# EAGLE design Qwiic_RFID_Tag (EAGLE 9.6.2)
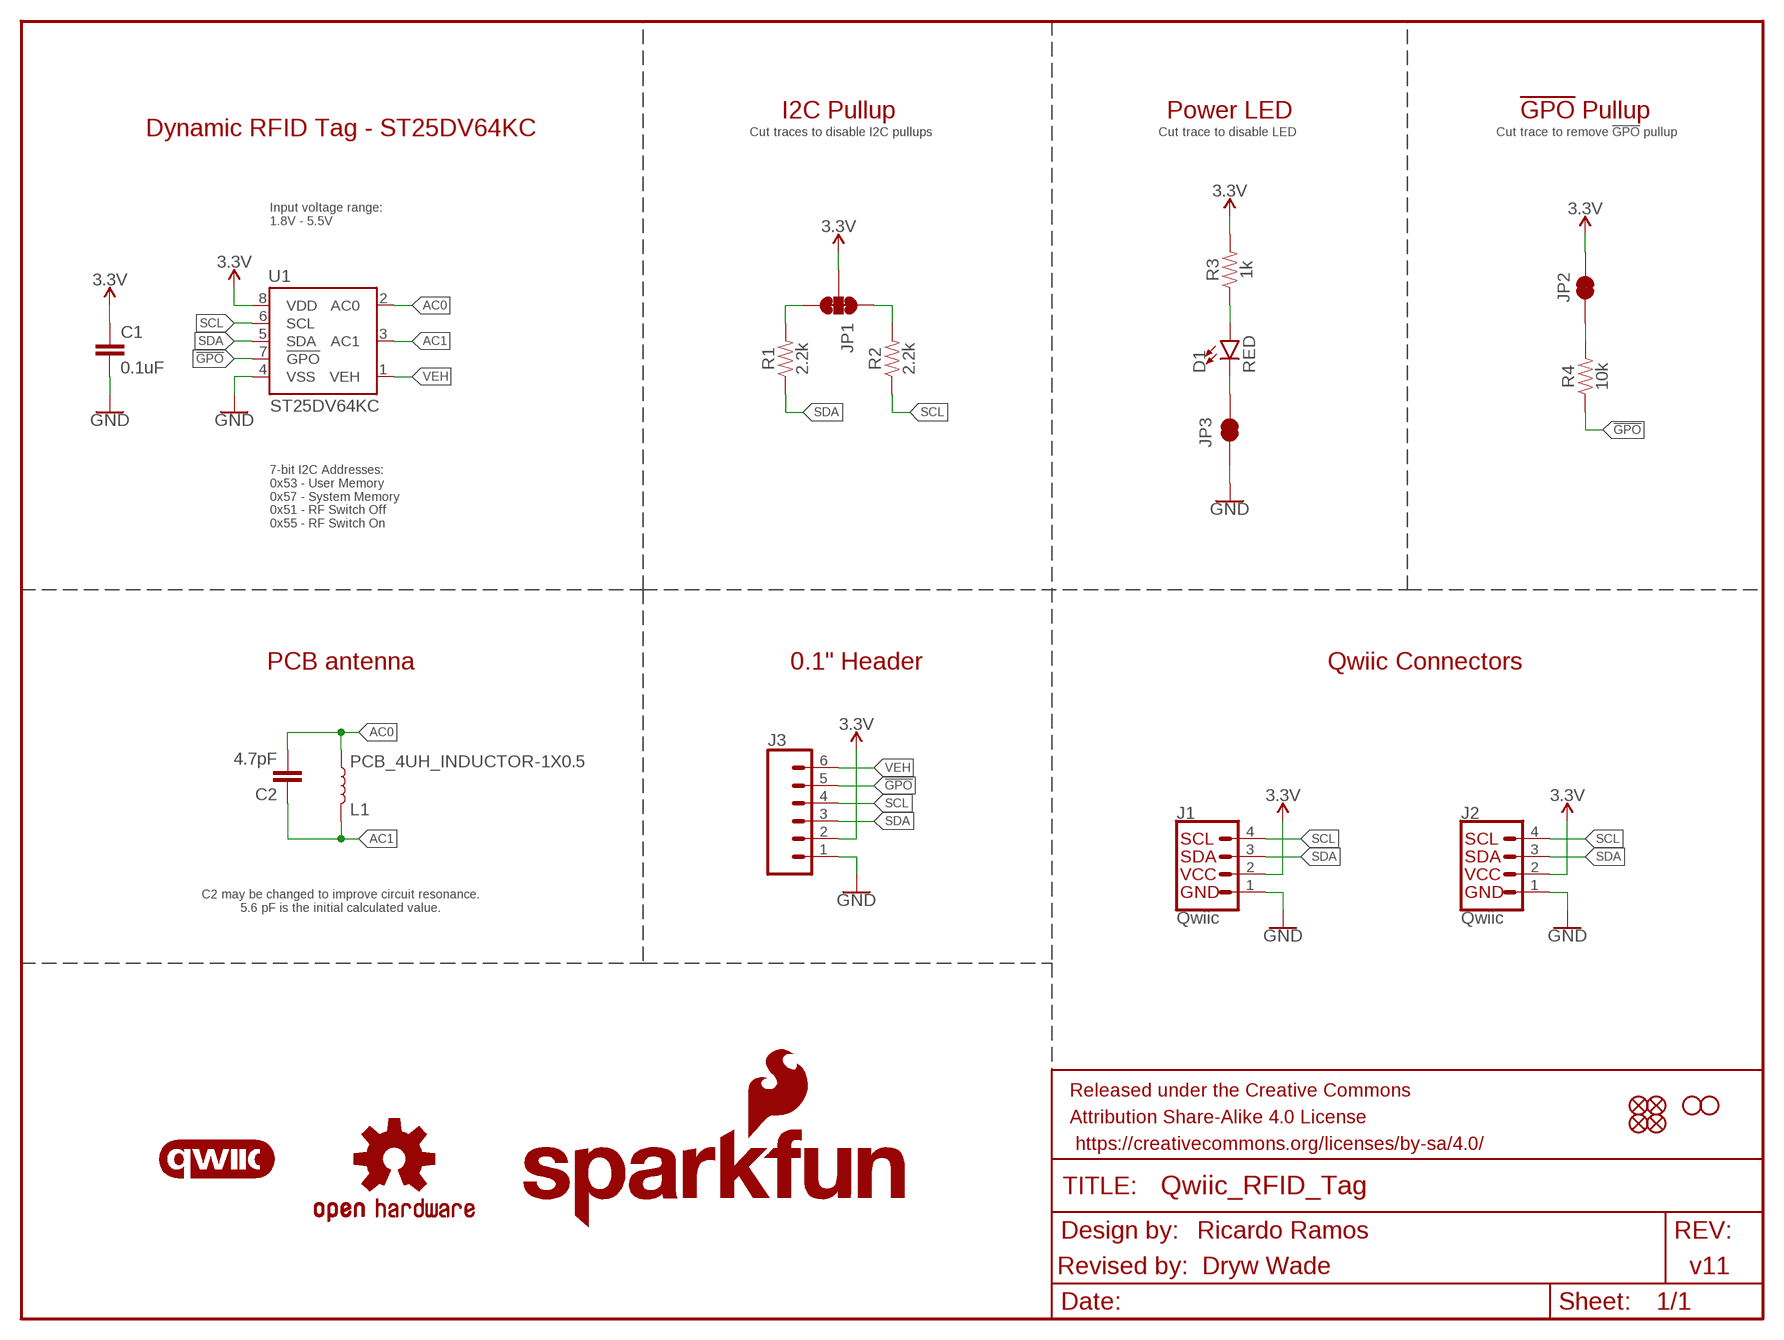
[diagram p0: schematic, sheet 1]

## Parts
C1  0.1uF  0.1UF-0603-25V-(+80/-20%)  [0603]
C2  4.7pF  4.7PF-0603-50V-5%  [0603]
D1  RED  LED-RED0603  [LED-0603]
FD1  FIDUCIAL1X2  [FIDUCIAL-1X2]
FD2  FIDUCIAL1X2  [FIDUCIAL-1X2]
FD3  FIDUCIAL1X2  [FIDUCIAL-1X2]
FD4  FIDUCIAL1X2  [FIDUCIAL-1X2]
FRAME2  FRAME-LETTER  [CREATIVE_COMMONS]
H3  STAND-OFF  [STAND-OFF]
H4  STAND-OFF  [STAND-OFF]
J1  Qwiic  QWIIC_CONNECTORJS-1MM  [JST04_1MM_RA]
J2  Qwiic  QWIIC_CONNECTORJS-1MM  [JST04_1MM_RA]
J3  CONN_06NO_SILK_FEMALE_PTH  [1X06_NO_SILK]
JP1  JUMPER-SMT_3_2-NC_TRACE_SILK  [SMT-JUMPER_3_2-NC_TRACE_SILK]
JP2  JUMPER-SMT_2_NC_TRACE_SILK  [SMT-JUMPER_2_NC_TRACE_SILK]
JP3  JUMPER-SMT_2_NC_TRACE_SILK  [SMT-JUMPER_2_NC_TRACE_SILK]
L1  PCB_4UH_INDUCTOR-1X0.5  [PCB_4UH_INDUCTOR_1X0.5]
LOGO1  OSHW-LOGOS  [OSHW-LOGO-S]
LOGO2  SFE_LOGO_NAME_FLAME.1_INCH  [SFE_LOGO_NAME_FLAME_.1]
LOGO3  QWIIC_LOGO_7MM  [QWIIC_7MM]
R1  2.2k  2.2KOHM-0603-1/10W-1%  [0603]
R2  2.2k  2.2KOHM-0603-1/10W-1%  [0603]
R3  1k  1KOHM-0603-1/10W-1%  [0603]
R4  10k  10KOHM-0603-1/10W-1%  [0603]
U1  ST25DV64KC  [SO08]

## Nets
3.3V: C1.1 J1.2 J2.2 J3.2 JP1.2 JP2.2 R3.2 U1.8(VDD)
!GPO!: J3.5 R4.1 U1.7(!GPO!)
AC0: C2.2 L1.IN2 U1.2(AC0)
AC1: C2.1 L1.IN1 U1.3(AC1)
GND: C1.2 J1.1 J2.1 J3.1 JP3.1 U1.4(VSS)
N$1: D1.C JP3.2
N$2: JP1.3 R1.2
N$3: JP1.1 R2.2
N$4: D1.A R3.1
N$5: JP2.1 R4.2
SCL: J1.4 J2.4 J3.4 R2.1 U1.6(SCL)
SDA: J1.3 J2.3 J3.3 R1.1 U1.5(SDA)
VEH: J3.6 U1.1(VEH)

## Notes on the sheet
- I2C Pullup | Power LED | !GPO! Pullup
- Dynamic RFID Tag - ST25DV64KC
- Cut traces to disable I2C pullups | Cut trace to disable LED | Cut trace to remove !GPO! pullup
- Input voltage range:
  1.8V - 5.5V
- 7-bit I2C Addresses:
  0x53 - User Memory
  0x57 - System Memory
  0x51 - RF Switch Off
  0x55 - RF Switch On
- PCB antenna | 0.1" Header | Qwiic Connectors
- C2 may be changed to improve circuit resonance.
  5.6 pF is the initial calculated value.
- Ricardo Ramos
- Revised by:  Dryw Wade | v11

## Library data of the parts
C1 = SparkFun-Capacitors:0.1UF: 0.1µF ceramic capacitors A capacitor is a passive two-terminal electrical component used to store electrical energy temporarily in an electric field.; PROD_ID: CAP-00810
C2 = SparkFun-Capacitors:4.7PF: 4.7pF ceramic capacitors A capacitor is a passive two-terminal electrical component used to store electrical energy temporarily in an electric field.; PROD_ID: CAP-07880
D1 = SparkFun-LED:LED-RED: Red SMD LED Used in manufacturing of most products at SparkFun Packages: 0603 - SMD 0603 package [Product Link] <http://docs.avagotech.com/docs/AV02-0551EN> 0603 SMART - SMD 0603 SMART package ( more efficient and expensive)[Product Link] <http://www.osram-os.com/Graphics/XPic2/00077099_0.pdf> 1206 - SMD1206 package [Product Link] <https://www.sparkfun.com/datasheets/DevTools/LilyPad/Q150OVS4.pdff> SparkFun Products: Pro Mini 328 -5V <https://www.sparkfun.com/products/821> RedBoard <https://www.sparkfun.com/products/12757> IOIO-OTG <https://www.sparkfun.com/products/13613>; PROD_ID: DIO-00819
FD1-FD4 = SparkFun-Aesthetics:FIDUCIAL: Fiducial Alignment Points Point-of-reference for pick-and-place machines and other optical instruments.
FRAME2 = SparkFun-Aesthetics:FRAME-LETTER: Schematic Frame - Letter Standard 8.5x11 US Letter frame
H3 H4 = SparkFun-Hardware:STAND-OFF: Stand Off Drill holes for mechanically mounting via screws, standoffs, etc. Note: Use the keepout ring to avoid running the screw head into surrounding components. Variant Overviews STAND-OFF - Mechanical footprint for a #4 phillips button head screw. STAND-OFF-TIGHT - Mechanical footprint for a #4 phillips button head screw, Example SparkFun Products Screw - Phillips Head (1/4", 4-40, 10 pack) <https://www.sparkfun.com/products/10453> (PRT-10453) Screw - Phillips Head (1/2", 4-40, 10 pack) <https://www.sparkfun.com/products/10452> (PRT-10452) Screw - Phillips Head (3/4", 4-40, 10 pack) <https://www.sparkfun.com/products/10451> (PRT-10451) Screw - Phillips Head (1", 4-40, 10 pack) <https://www.sparkfun.com/products/10450> (PRT-10450)
J1 J2 = SparkFun-Connectors:QWIIC_CONNECTOR: SparkFun I2C Standard Qwiic Connector An SMD 1mm pitch JST connector makes it easy and quick (get it? Qwiic?) to connect I2C devices to each other. The Qwiic system <http://www.sparkfun.com/qwiic> enables fast and solderless connection between popular platforms and various sensors and actuators. We carry 200mm <https://www.sparkfun.com/products/14204>, 100mm <https://www.sparkfun.com/products/14205>, 50mm <https://www.sparkfun.com/products/14206>, and breadboard friendly <https://www.sparkfun.com/products/14207> Qwiic cables. We also offer 10 pcs strips <https://www.sparkfun.com/products/14323> the SMD connectors.; PROD_ID: CONN-13694; VALUE: QWIIC_RIGHT_ANGLE
J3 = SparkFun-Connectors:CONN_06: Multi connection point. Often used as Generic Header-pin footprint for 0.1 inch spaced/style header connections On any of the 0.1 inch spaced packages, you can populate with these: Break Away Headers - Straight <https://www.sparkfun.com/products/116> (PRT-00116) Break Away Male Headers - Right Angle <https://www.sparkfun.com/products/553> (PRT-00553) Female Headers <https://www.sparkfun.com/products/115> (PRT-00115) Break Away Headers - Machine Pin <https://www.sparkfun.com/products/117> (PRT-00117) Break Away Female Headers - Swiss Machine Pin <https://www.sparkfun.com/products/743> (PRT-00743) Arduino Stackable Header - 6 Pin <https://www.sparkfun.com/products/9280> (PRT-09280) Screw Terminals 2.54mm Pitch (6-Pin) <https://www.sparkfun.com/products/16499> (PRT-16499) For SCREWTERMINALS and SPRING TERMINALS visit here: Screw Terimnals on SparkFun.com <https://www.sparkfun.com/search/results?term=Screw+Terminals> (5mm/3.5mm/2.54mm spacing) This device is also useful as a general connection point to wire up your design to another part of your project. Our various solder wires solder well into these plated through hole pads. Hook-Up Wire - Assortment (Stranded, 22 AWG) <https://www.sparkfun.com/products/11375> (PRT-11375) Hook-Up Wire - Assortment (Solid Core, 22 AWG) <https://www.sparkfun.com/products/11367> (PRT-11367) View the entire wire category on our website here <https://www.sparkfun.com/categories/141>; PROD_ID: CONN-08437
JP1 = SparkFun-Jumpers:JUMPER-SMT_3_2-NC_TRACE: Normally closed trace jumper (2 of 2 connections) This jumper has a trace between all three pads so they are normally closed (NC). Use a razor knife to open the connection(s). For best results follow the IPC guidelines for cutting traces: Cutout at least 0.063 mm (0.005 in). Remove all loose material to clean up the cut area. Seal the cut with an approved epoxy. Reapply solder to reclose the connection(s).
JP2 JP3 = SparkFun-Jumpers:JUMPER-SMT_2_NC_TRACE: Normally closed trace jumper This jumper has a trace between two pads so it's normally closed (NC). Use a razor knife to open the connection. For best results follow the IPC guidelines for cutting traces: Cutout at least 0.063 mm (0.005 in). Remove all loose material to clean up the cut area. Seal the cut with an approved epoxy. Reapply solder to reclose the connection.
L1 = SparkFun-Coils:PCB_4UH_INDUCTOR
LOGO1 = SparkFun-Aesthetics:OSHW-LOGO: Open-Source Hardware (OSHW) Logo This logo indicates the piece of hardware it is found on incorporates a OSHW license and/or adheres to the definition of open source hardware found here: http://freedomdefined.org/OSHW
LOGO2 = SparkFun-Aesthetics:SFE_LOGO_NAME_FLAME: SparkFun Font Logo w/ Flame This is the SparkFun full logo. The logo on the schematic will always be the same size; the package variant is the height of the flame part of the logo. Default layer for the logo on the board is tSilk.
LOGO3 = SparkFun-Aesthetics:QWIIC_LOGO: Qwiic Logos for placement on schematic and PCB. The 5.5mm silk logo is best for placing next to Qwiic connector.
R1 R2 = SparkFun-Resistors:2.2KOHM: 2.2kΩ resistor A resistor is a passive two-terminal electrical component that implements electrical resistance as a circuit element. Resistors act to reduce current flow, and, at the same time, act to lower voltage levels within circuits. - Wikipedia; PROD_ID: RES-08272
R3 = SparkFun-Resistors:1KOHM: 1kΩ resistor A resistor is a passive two-terminal electrical component that implements electrical resistance as a circuit element. Resistors act to reduce current flow, and, at the same time, act to lower voltage levels within circuits. - Wikipedia; PROD_ID: RES-07856
R4 = SparkFun-Resistors:10KOHM: 10kΩ resistor A resistor is a passive two-terminal electrical component that implements electrical resistance as a circuit element. Resistors act to reduce current flow, and, at the same time, act to lower voltage levels within circuits. - Wikipedia; PROD_ID: RES-00824
U1 = SparkFun-RF:ST25DV64KC: Dynamic NFC/RFID Dynamic NFC/RFID tag IC with 4-Kbit, 16-Kbit or 64-Kbit EEPROM, fast transfer mode capability and optimized I2C.; PROD_ID: IC-16315

## Board
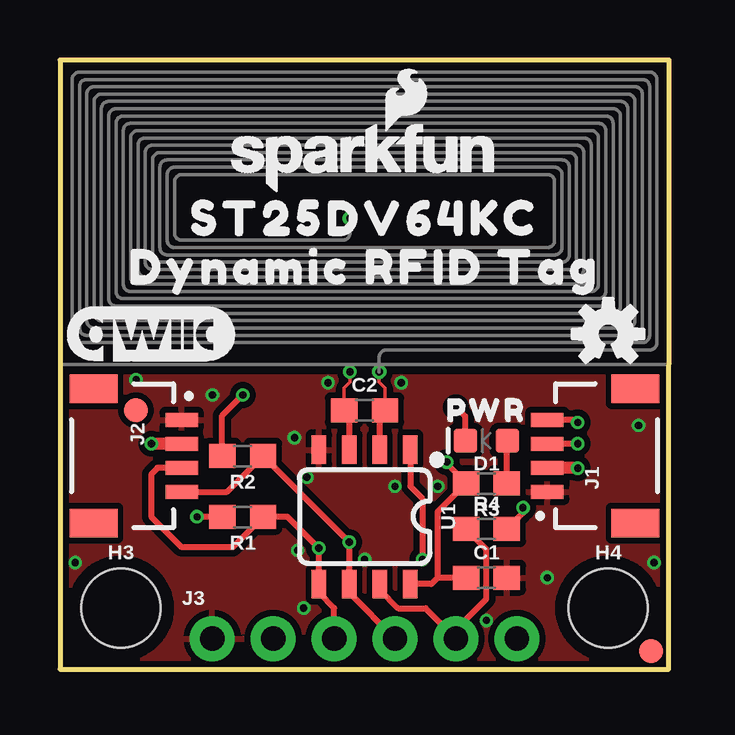
[diagram p1: board, top side]
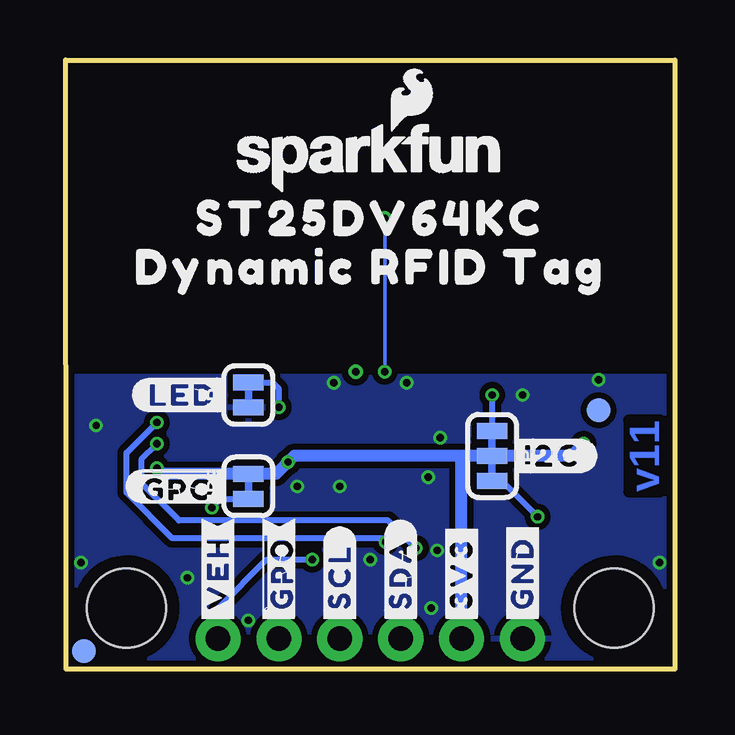
[diagram p2: board, bottom side, seen from below]

Size 25.4 x 25.4 mm. Coordinates in mm from the lower left corner, seen from the top.
Outline: 0,0 25.38,0 25.4,25.4 0,25.4 0,0
Copper layers (1*16): Top 0.035mm / dielectric 1.5mm / Bottom 0.035mm
Design rules "SparkFun-2-Layer-Minimum-JLCPCB": minimum track width 5mil, minimum drill 0.3mm, track to track 5mil, track to pad 5mil, pad to pad 5mil, via to via 5mil, smd to smd 5mil, copper to edge 7mil, drill to drill 7mil, minimum pad ring 5mil, minimum via ring 5mil, stop-mask expansion 2.5mil, vias tented up to drill 25mil, thermal gap 10mil

### Footprints (pad centres in the part's own frame; a part is rotated, then mirrored left to right if it is on the bottom)
0603 = smd 1.1 x 1: 1 -0.85,0; 2 0.85,0
LED-0603 = smd 1 x 1: A -0.877,0; C 0.877,0
FIDUCIAL-1X2 = smd 1 x 1: 1 0,0
STAND-OFF = hole 3.302: 0,0
JST04_1MM_RA = smd 0.6 x 1.35: 1 -1.5,0; 2 -0.5,0; 3 0.5,0; 4 1.5,0 | smd 1.2 x 2: NC1 2.8,-3.675; NC2 -2.8,-3.675
1X06_NO_SILK = drill 1.016 pad 1.88: 1 0,0; 2 2.54,0; 3 5.08,0; 4 7.62,0; 5 10.16,0; 6 12.7,0
SMT-JUMPER_3_2-NC_TRACE_SILK = smd 0.66 x 1.27: 1 -1.041,0; 2 0,0; 3 1.041,0
SMT-JUMPER_2_NC_TRACE_SILK = smd 0.66 x 1.27: 1 -0.521,0; 2 0.521,0
PCB_4UH_INDUCTOR_1X0.5 = drill 0.305 pad 0.61: IN1 -0.61,6.096; IN2 0.61,-0.305
SO08 = smd 0.6 x 1.2: 1 -1.905,-2.8; 2 -0.635,-2.8; 3 0.635,-2.8; 4 1.905,-2.8; 5 1.905,2.8; 6 0.635,2.8; 7 -0.635,2.8; 8 -1.905,2.8

### Placement (x,y rotation side)
C1  17.78,3.81 0 top
C2  12.7,10.79 0 top
D1  17.78,9.53 180 top
FD1  3.17,10.79 0 bottom
FD2  3.17,10.79 0 top
FD3  24.64,0.76 0 bottom
FD4  24.64,0.76 0 top
FRAME2  -10.16,-29.21 0 top  (outside the outline)
H3  2.54,2.54 0 top
H4  22.86,2.54 0 top
J1  20.32,8.89 90 top
J2  5.08,8.89 270 top
J3  6.35,1.27 0 top
JP1  7.62,8.89 270 bottom
JP2  17.78,7.62 90 bottom
JP3  17.78,11.43 90 bottom
L1  12.7,12.7 0 top
LOGO1  22.86,13.97 0 top
LOGO2  12.7,21.34 0 top
LOGO3  3.81,13.97 0 top
LOGO4  SFE_LOGO_NAME_FLAME.1_INCH  [SFE_LOGO_NAME_FLAME_.1]  12.7,21.34 0 bottom
R1  7.62,6.35 180 top
R2  7.62,8.89 180 top
R3  17.78,7.75 180 top
R4  17.78,5.84 0 top
U1  12.7,6.35 180 top
U$1  [#I2C#0]  6.99,8.89 0 bottom
U$3  [#3V3#0]  8.89,1.78 90 bottom
U$9  [PWR11]  17.78,10.79 0 top
U$10  [DYNAMIC_RFID_TAG0]  12.7,16.76 0 top
U$11  [DYNAMIC_RFID_TAG0]  12.7,16.76 0 bottom
U$13  [ST25DV64KC5984]  12.7,18.8 0 top
U$16  [##GPO##9]  18.41,7.62 0 bottom
U$17  [#LED#10]  18.41,11.43 0 bottom
U$18  [#GND#4]  6.35,1.78 90 bottom
U$20  [#SDA#5]  11.43,1.78 90 bottom
U$21  [#SCL#6]  13.97,1.78 90 bottom
U$22  [##GPO##8]  16.51,1.78 90 bottom
U$23  [#VEH#7]  19.05,1.78 90 bottom
U$24  [ST25DV64KC5984]  12.7,18.8 0 bottom

### Tracks (layer width: path | path; a pad name or v marks a point on that pad's centre or on a via)
3.3V  (via drill 0.3)
  Top 0.254: C1.1 15.75,3.81 | 15.75,3.81 15.49,3.55 U1.8 | 15.75,3.81 15.75,6.57 R3.2 16.13,8.55 v16.13,8.64
  Top 0.508: J2.2 v3.82,9.39 v3.81,9.4 | v21.59,8.38 v21.58,8.39 J1.2
  Bottom 0.508: v3.81,9.4 4.32,8.89 JP1.2 8.89,8.89 | J3.2 8.89,8.89 | 8.89,8.89 15.88,8.89 v16.13,8.64 16.62,8.14 JP2.2 21.35,8.14 v21.59,8.38
!GPO!
  Top 0.254: U1.7 13.34,3.3 14.1,2.54 15.24,2.54 J3.5 16.51,1.65 17.78,2.92 17.78,4.99 R4.1
AC0
  Top 0.152: L1.IN2 13.31,11.96 13.55,11.72 C2.2
  Top 0.254: U1.2 13.34,10.58 C2.2
AC1  (via drill 0.3)
  Top 0.152: C2.1 11.85,11.72 12.09,11.96 v12.09,12.39
  Top 0.254: U1.3 12.06,10.58 C2.1
  Bottom 0.152: L1.IN1 v12.09,12.39
GND  (via drill 0.3)
  other vias: 20.32,3.81 10.16,2.54 12.7,4.57 13.97,7.62 15.75,7.62 9.91,4.95 10.29,8 9.78,9.65 17.78,2.03 0.64,4.45 3.17,12.06 6.35,11.43 11.18,11.94 14.22,11.94 24.13,10.16 24.77,4.45
  pour Top (isolate 0.254): 0,0 0,12.19 25.4,12.19 25.4,0
  pour Bottom (isolate 0.254): 0,12.19 25.4,12.19 25.4,0 0,0
N$1  (via drill 0.3)
  Top 0.254: D1.C 16.89,10.54 v16.51,10.92
  Bottom 0.254: JP3.2 16.78,11.95 16.51,11.68 v16.51,10.92
N$2  (via drill 0.3)
  Top 0.254: R1.2 v5.71,6.35
  Bottom 0.254: v5.71,6.35 7.21,7.85 JP1.3
N$3  (via drill 0.3)
  Top 0.254: R2.2 6.77,10.58 v7.62,11.43
  Bottom 0.254: v7.62,11.43 JP1.1
N$4
  Top 0.254: R3.1 18.63,9.5 D1.A
N$5  (via drill 0.3)
  Top 0.254: R4.2 19.3,6.52 v19.3,6.73
  Bottom 0.254: v19.3,6.73 18.94,7.1 JP2.1
SCL  (via drill 0.3)
  Top 0.254: J3.4 12.06,3.17 U1.6 v12.06,5.29 R2.1 6.97,7.39 J2.4 | v21.59,10.29 21.49,10.39 J1.4
  Bottom 0.254: v12.06,5.29 12.23,5.46 20.95,5.46 22.86,7.37 22.86,9.02 v21.59,10.29
SDA  (via drill 0.3)
  Top 0.254: J3.3 11.43,2.54 10.79,3.17 U1.5 v10.79,5.04 9.49,6.35 R1.1 7.2,5.08 5.08,5.08 3.81,6.35 3.81,8.13 4.07,8.39 J2.3 | v21.59,9.4 v21.58,9.39 J1.3
  Bottom 0.254: v10.79,5.04 11.95,6.2 20.68,6.2 22.25,7.77 22.25,8.74 v21.59,9.4
VEH  (via drill 0.3)
  Top 0.254: U1.1 14.61,7.62 15.11,7.11 v15.11,4.57
  Bottom 0.254: J3.6 19.05,2.54 17.02,4.57 v15.11,4.57

### Text on the board
Bottom: v11
Measures: Units: inches
tDocu: Ricardo Ramos | Revised by: Dryw Wade